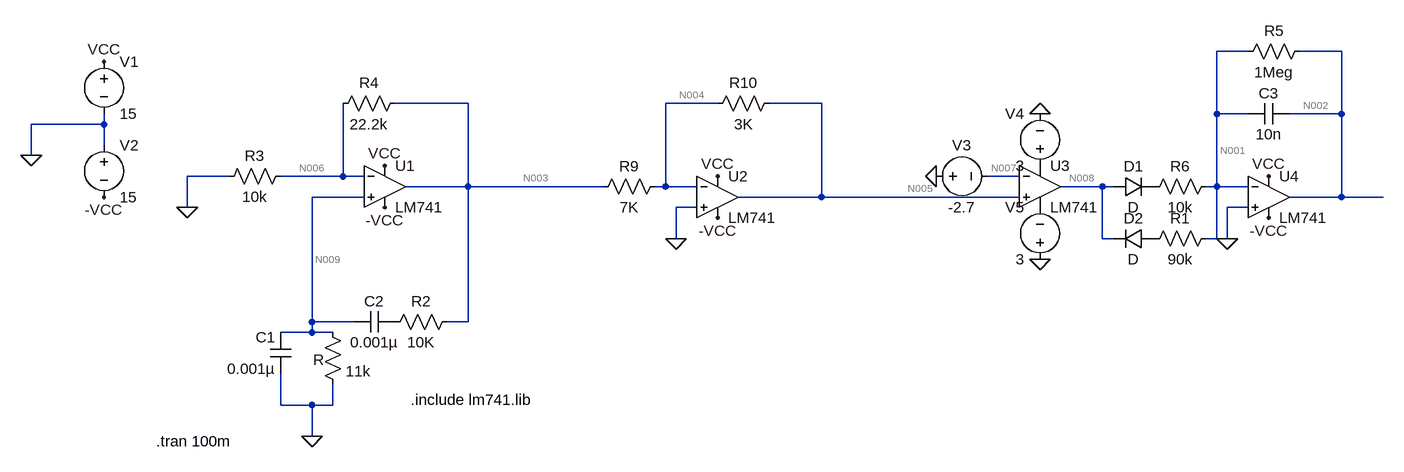
[diagram p0: schematic Integrater.asc]
Integrater.asc, the LTspice schematic file:
Version 4.1
SHEET 1 2120 1828
WIRE 1520 -64 1472 -64
WIRE 1664 -64 1600 -64
WIRE 320 16 208 16
WIRE 704 16 624 16
WIRE 864 16 784 16
WIRE 1472 32 1472 -64
WIRE 1520 32 1472 32
WIRE 1664 32 1664 -64
WIRE 1664 32 1584 32
WIRE -240 48 -240 32
WIRE -240 48 -352 48
WIRE -240 80 -240 48
WIRE -352 96 -352 48
WIRE -48 128 -112 128
WIRE 128 128 128 16
WIRE 128 128 32 128
WIRE 160 128 128 128
WIRE 1168 128 1120 128
WIRE 320 144 320 16
WIRE 320 144 224 144
WIRE 528 144 320 144
WIRE 624 144 624 16
WIRE 624 144 608 144
WIRE 672 144 624 144
WIRE 1296 144 1232 144
WIRE 1312 144 1296 144
WIRE 1472 144 1472 32
WIRE 1472 144 1456 144
WIRE 1520 144 1472 144
WIRE 160 160 80 160
WIRE 864 160 864 16
WIRE 864 160 736 160
WIRE 1168 160 864 160
WIRE 1664 160 1664 32
WIRE 1664 160 1584 160
WIRE 1728 160 1664 160
WIRE -112 176 -112 128
WIRE 672 176 640 176
WIRE 1520 176 1488 176
WIRE 640 224 640 176
WIRE 1296 224 1296 144
WIRE 1312 224 1296 224
WIRE 1472 224 1472 144
WIRE 1472 224 1456 224
WIRE 1488 224 1488 176
WIRE 80 352 80 160
WIRE 144 352 80 352
WIRE 320 352 320 144
WIRE 320 352 288 352
WIRE 80 368 80 352
WIRE 80 368 32 368
WIRE 112 368 80 368
WIRE 32 480 32 432
WIRE 80 480 32 480
WIRE 112 480 112 448
WIRE 112 480 80 480
WIRE 80 528 80 480
FLAG 80 528 0
FLAG -112 176 0
FLAG -352 96 0
FLAG -240 -48 VCC
FLAG -240 160 -VCC
FLAG 192 112 VCC
FLAG 192 176 -VCC
FLAG 640 224 0
FLAG 704 128 VCC
FLAG 704 192 -VCC
FLAG 1040 128 0
FLAG 1200 32 0
FLAG 1200 256 0
FLAG 1552 128 VCC
FLAG 1552 192 -VCC
FLAG 1488 224 0
SYMBOL OpAmps\\opamp2 192 80 R0
SYMATTR InstName U1
SYMATTR Value LM741
SYMBOL cap 48 432 R180
WINDOW 0 24 56 Left 2
WINDOW 3 24 8 Left 2
SYMATTR InstName C1
SYMATTR Value 0.001µ
SYMATTR SpiceLine V=250 Irms=0 Rser=0 Lser=0
SYMBOL res 96 352 R0
WINDOW 0 -14 58 Left 2
SYMATTR InstName R
SYMATTR Value 11k
SYMATTR SpiceLine tol=1
SYMBOL cap 208 336 R90
WINDOW 0 0 32 VBottom 2
WINDOW 3 32 32 VTop 2
SYMATTR InstName C2
SYMATTR Value 0.001µ
SYMATTR SpiceLine V=250 Irms=0 Rser=0
SYMBOL res 304 336 R90
WINDOW 0 0 56 VBottom 2
WINDOW 3 32 56 VTop 2
SYMATTR InstName R2
SYMATTR Value 10K
SYMATTR SpiceLine tol=0
SYMBOL res 48 112 R90
WINDOW 0 0 56 VBottom 2
WINDOW 3 32 56 VTop 2
SYMATTR InstName R3
SYMATTR Value 10k
SYMATTR SpiceLine tol=1 pwr=0.1
SYMBOL res 224 0 R90
WINDOW 0 0 56 VBottom 2
WINDOW 3 32 56 VTop 2
SYMATTR InstName R4
SYMATTR Value 22.2k
SYMATTR SpiceLine tol=1 pwr=0.1
SYMBOL voltage -240 -64 R0
WINDOW 123 0 0 Left 0
WINDOW 39 0 0 Left 0
SYMATTR InstName V1
SYMATTR Value 15
SYMBOL voltage -240 64 R0
WINDOW 123 0 0 Left 0
WINDOW 39 0 0 Left 0
SYMATTR InstName V2
SYMATTR Value 15
SYMBOL OpAmps\\opamp2 704 96 R0
SYMATTR InstName U2
SYMATTR Value LM741
SYMBOL res 624 128 R90
WINDOW 0 0 56 VBottom 2
WINDOW 3 32 56 VTop 2
SYMATTR InstName R9
SYMATTR Value 7K
SYMBOL res 800 0 R90
WINDOW 0 0 56 VBottom 2
WINDOW 3 32 56 VTop 2
SYMATTR InstName R10
SYMATTR Value 3K
SYMBOL OpAmps\\opamp2 1200 80 R0
SYMATTR InstName U3
SYMATTR Value LM741
SYMBOL voltage 1024 128 R270
WINDOW 0 32 56 VTop 2
WINDOW 3 -32 56 VBottom 2
WINDOW 123 0 0 Left 0
WINDOW 39 0 0 Left 0
SYMATTR InstName V3
SYMATTR Value -2.7
SYMBOL voltage 1200 128 R180
WINDOW 0 24 96 Left 2
WINDOW 3 24 16 Left 2
WINDOW 123 0 0 Left 0
WINDOW 39 0 0 Left 0
SYMATTR InstName V4
SYMATTR Value 3
SYMBOL voltage 1200 272 R180
WINDOW 0 24 96 Left 2
WINDOW 3 24 16 Left 2
WINDOW 123 0 0 Left 0
WINDOW 39 0 0 Left 0
SYMATTR InstName V5
SYMATTR Value 3
SYMBOL OpAmps\\opamp2 1552 96 R0
SYMATTR InstName U4
SYMATTR Value LM741
SYMBOL cap 1584 16 R90
WINDOW 0 0 32 VBottom 2
WINDOW 3 32 32 VTop 2
SYMATTR InstName C3
SYMATTR Value 10n
SYMBOL res 1616 -80 R90
WINDOW 0 0 56 VBottom 2
WINDOW 3 32 56 VTop 2
SYMATTR InstName R5
SYMATTR Value 1Meg
SYMBOL res 1472 128 R90
WINDOW 0 0 56 VBottom 2
WINDOW 3 32 56 VTop 2
SYMATTR InstName R6
SYMATTR Value 10k
SYMBOL diode 1312 160 R270
WINDOW 0 32 32 VTop 2
WINDOW 3 0 32 VBottom 2
SYMATTR InstName D1
SYMBOL diode 1376 208 R90
WINDOW 0 0 32 VBottom 2
WINDOW 3 32 32 VTop 2
SYMATTR InstName D2
SYMBOL res 1472 208 R90
WINDOW 0 0 56 VBottom 2
WINDOW 3 32 56 VTop 2
SYMATTR InstName R1
SYMATTR Value 90k
TEXT 232 472 Left 2 !.include lm741.lib
TEXT -160 536 Left 2 !.tran 100m

The netlist it stands for:
* Integrater.asc
X§U1 N009 N006 VCC -VCC N003 LM741  ; pins In+ In- V+ V- OUT
C1 0 N009 0.001µ V=250 Irms=0 Rser=0 Lser=0
R N009 0 11k tol=1
C2 P001 N009 0.001µ V=250 Irms=0 Rser=0
R2 N003 P001 10K tol=0
R3 N006 0 10k tol=1 pwr=0.1
R4 N003 N006 22.2k tol=1 pwr=0.1
V1 VCC 0 15
V2 0 -VCC 15
X§U2 0 N004 VCC -VCC N005 LM741  ; pins In+ In- V+ V- OUT
R9 N004 N003 7K
R10 N005 N004 3K
X§U3 N005 N007 P002 P003 N008 LM741  ; pins In+ In- V+ V- OUT
V3 0 N007 -2.7
V4 P002 0 3
V5 0 P003 3
X§U4 0 N001 VCC -VCC N002 LM741  ; pins In+ In- V+ V- OUT
C3 N002 N001 10n
R5 N002 N001 1Meg
R6 N001 P004 10k
D1 N008 P004 D
D2 P005 N008 D
R1 N001 P005 90k
.model D D
.lib standard.dio
.include lm741.lib
.tran 100m
.backanno
.end

* Results of the author's LTspice run, read from the files saved beside the schematic
* Operating Point, zero values left out:
*   V(n006) = 363.5 µV
*   V(-vcc) = -15 V
*   V(n003) = 3.432 mV
*   V(n004) = 1 mV
*   V(p002) = 3 V
*   V(n008) = -2.025 V
*   V(n001) = -172.1 mV
*   V(p004) = -172.1 mV
*   V(n009) = -636.4 µV
*   V(vcc) = 15 V
*   V(p001) = 3.432 mV
*   V(n005) = 263.4 µV
*   V(n007) = 2.7 V
*   V(p003) = -3 V
*   V(n002) = 14.02 V
*   V(p005) = -1.479 V
*   I(R4) = 138.2 nA
*   I(V1) = -5.108 mA
*   I(R10) = -245.5 nA
*   I(V5) = -1.3 mA
*   I(R5) = 14.2 µA
*   I(V3) = 5.579 µA
*   I(D1) = -1.862 pA
*   I(R1) = 14.52 µA
*   I(R3) = 36.35 nA
*   I(R9) = -347.4 nA
*   I(R6) = 1.862 pA
*   I(R) = -57.86 nA
*   I(V2) = -5.1 mA
*   I(V4) = -1.286 mA
*   I(D2) = 14.52 µA